# EAGLE design MS5803-01BA_I2C (EAGLE 9.6.2)
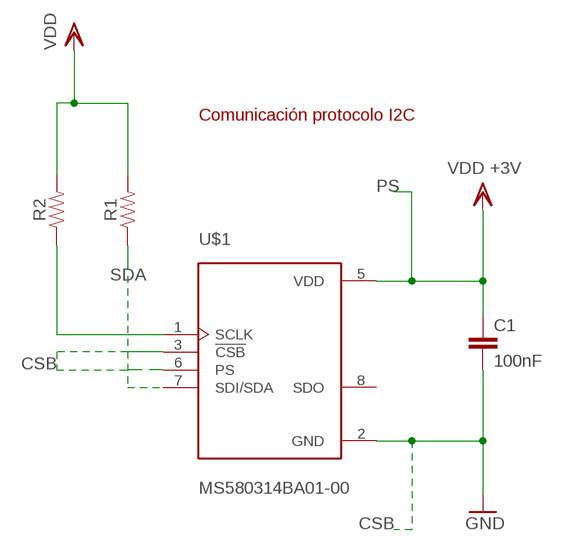
[diagram p0: schematic, sheet 1]

## Parts
C1  100nF  1.0NF/1000PF-1206-2KV-10%  [1206]
R1  RESISTOR1206  [1206]
R2  RESISTOR1206  [1206]
U$1  MS580314BA01-00  [XDCR_MS580314BA01-00]

## Nets
CSB: C1.2 U$1.2(GND) U$1.3(!CSB) U$1.6(PS) ; supply symbol labelled GND
PS: C1.1 U$1.5(VDD) ; supply symbol labelled VDD +3V
SCLK: R2.1 U$1.1(SCLK)
SDA: R1.1 U$1.7(SDI/SDA)
VDD: R1.2 R2.2
Unconnected: U$1.8(SDO)

## Notes on the sheet
- Comunicación protocolo I2C

## Library data of the parts
C1 = SparkFun-Capacitors:1.0NF/1000PF: 1nF/1,000pF ceramic capacitors A capacitor is a passive two-terminal electrical component used to store electrical energy temporarily in an electric field.; PROD_ID: CAP-16238; VALUE: 1nF
R1 R2 = SparkFun-Resistors:RESISTOR: Generic Resistor Package
U$1 = MS580314BA01-00:MS580314BA01-00: MINIATURE ALTIMETER MODULE Check availability <https://pricing.snapeda.com/parts/MS580314BA01-00/Measurement%20Specialties/view-part?ref=eda>; AVAILABILITY: In Stock; CHECK_PRICES: https://www.snapeda.com/parts/MS580314BA01-00/Measurement+Specialites/view-part/?ref=eda; DESCRIPTION: Pressure Sensor 203.05PSI (1400kPa) Absolute 24 b 8-SMD Module; MF: Measurement Specialties; MP: MS580314BA01-00; PACKAGE: None; PRICE: None; SNAPEDA_LINK: https://www.snapeda.com/parts/MS580314BA01-00/Measurement+Specialites/view-part/?ref=snap

## Board
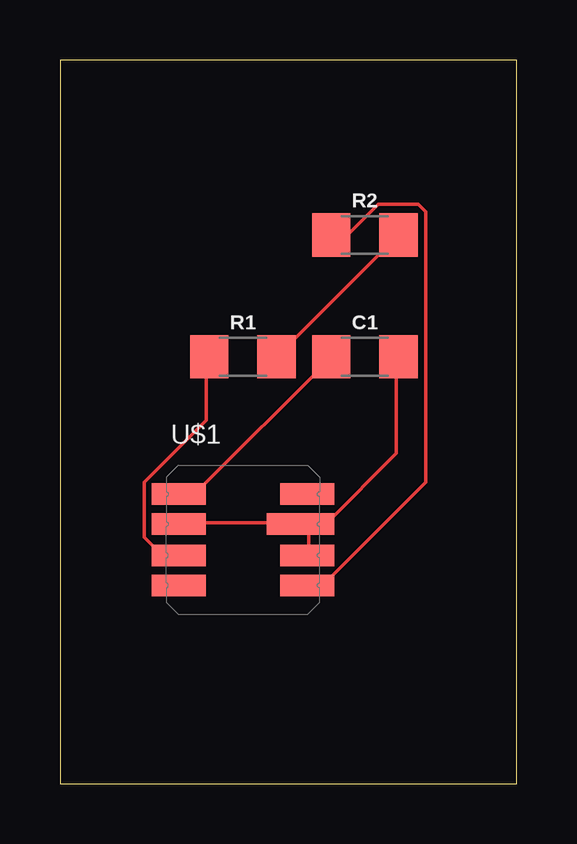
[diagram p1: board, top side]

Size 19.03 x 30.15 mm. Coordinates in mm from the lower left corner, seen from the top.
Outline: 0,0 19.03,0 19.03,30.15 0,30.15 0,0
Copper layers (1*16): Top 0.035mm / dielectric 1.5mm / Bottom 0.035mm
Design rules "default": minimum track width 6mil, minimum drill 0.35mm, track to track 6mil, track to pad 6mil, pad to pad 6mil, via to via 6mil, smd to smd 6mil, copper to edge 40mil, drill to drill 6mil, minimum pad ring 10mil, minimum via ring 8mil, stop-mask expansion 4mil, vias tented up to drill 0mil, thermal gap 10mil

### Footprints (pad centres in the part's own frame; a part is rotated, then mirrored left to right if it is on the bottom)
1206 = smd 1.6 x 1.8: 1 -1.4,0; 2 1.4,0
XDCR_MS580314BA01-00 = smd 2.25 x 0.9: 1 2.675,-1.899; 2 2.675,-0.649; 4 2.675,1.901; 5 -2.675,1.901; 6 -2.675,0.651; 7 -2.675,-0.649; 8 -2.675,-1.899 | smd 2.8 x 0.9: 3 2.4,0.651

### Placement (x,y rotation side)
C1  12.7,17.78 0 top
R1  7.62,17.78 0 top
R2  12.7,22.86 0 top
U$1  7.62,10.16 0 top

### Tracks (layer width: path | path; a pad name or v marks a point on that pad's centre or on a via)
CSB
  Top 0.152: 10.36,10.87 10.06,10.87 U$1.3 | 10.36,10.87 11.12,10.87 14.02,13.77 14.02,17.73 C1.2 | 10.36,10.87 10.36,9.65 U$1.2 | 10.36,10.87 U$1.3 | U$1.6 5.03,10.87 9.91,10.87 U$1.3
PS
  Top 0.152: C1.1 11.28,17.73 5.64,12.09 5.03,12.09 U$1.5
SCLK
  Top 0.152: R2.1 11.43,22.91 12.04,22.91 13.26,24.13 14.93,24.13 15.24,23.82 15.24,12.55 10.97,8.28 10.36,8.28 U$1.1
SDA
  Top 0.152: R1.1 6.1,17.73 6.1,15.14 3.51,12.55 3.51,10.26 4.12,9.65 4.88,9.65 U$1.7
VDD
  Top 0.152: R1.2 9.14,17.88 14.02,22.76 R2.2